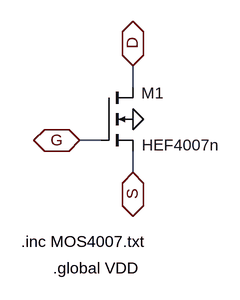
[diagram p0: schematic NMOSX.asc]
NMOSX.asc, the LTspice schematic file:
Version 4
SHEET 1 2472 680
WIRE -912 -240 -912 -272
WIRE -960 -160 -992 -160
WIRE -912 -112 -912 -144
FLAG -912 -192 0
FLAG -992 -160 G
IOPIN -992 -160 BiDir
FLAG -912 -272 D
IOPIN -912 -272 BiDir
FLAG -912 -112 S
IOPIN -912 -112 BiDir
SYMBOL nmos4 -960 -240 R0
WINDOW 0 61 9 Left 2
WINDOW 3 62 87 Left 2
SYMATTR InstName M1
SYMATTR Value HEF4007n
TEXT -1080 -8 Left 2 !.inc MOS4007.txt
TEXT -1032 32 Left 2 !.global VDD

The netlist it stands for:
* NMOSX.asc
M1 D G S 0 HEF4007n
.model NMOS NMOS
.model PMOS PMOS
.lib standard.mos
.inc MOS4007.txt
.global VDD
.backanno
.end